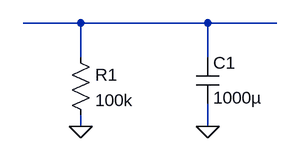
[diagram p0: schematic energy storage block.asc]
energy storage block.asc, the LTspice schematic file:
Version 4.1
SHEET 1 880 680
WIRE 16 48 -64 48
WIRE 192 48 16 48
WIRE 288 48 192 48
WIRE 16 96 16 48
WIRE 192 96 192 48
WIRE 16 192 16 176
WIRE 192 192 192 160
FLAG 192 192 0
FLAG 16 192 0
SYMBOL res 0 80 R0
SYMATTR InstName R1
SYMATTR Value 100k
SYMBOL cap 176 96 R0
SYMATTR InstName C1
SYMATTR Value 1000µ

The netlist it stands for:
* energy storage block.asc
R1 N001 0 100k
C1 N001 0 1000µ
.backanno
.end